# Altium schematic sheet CPU HMI.SchDoc
size A3; Engineer: T.Wadolowski; Address1: ul. Żurawia 71; Address2: 15-540 Bialystok; DocumentNumber: 1.0; SheetNumber: 1; SheetTotal: 1
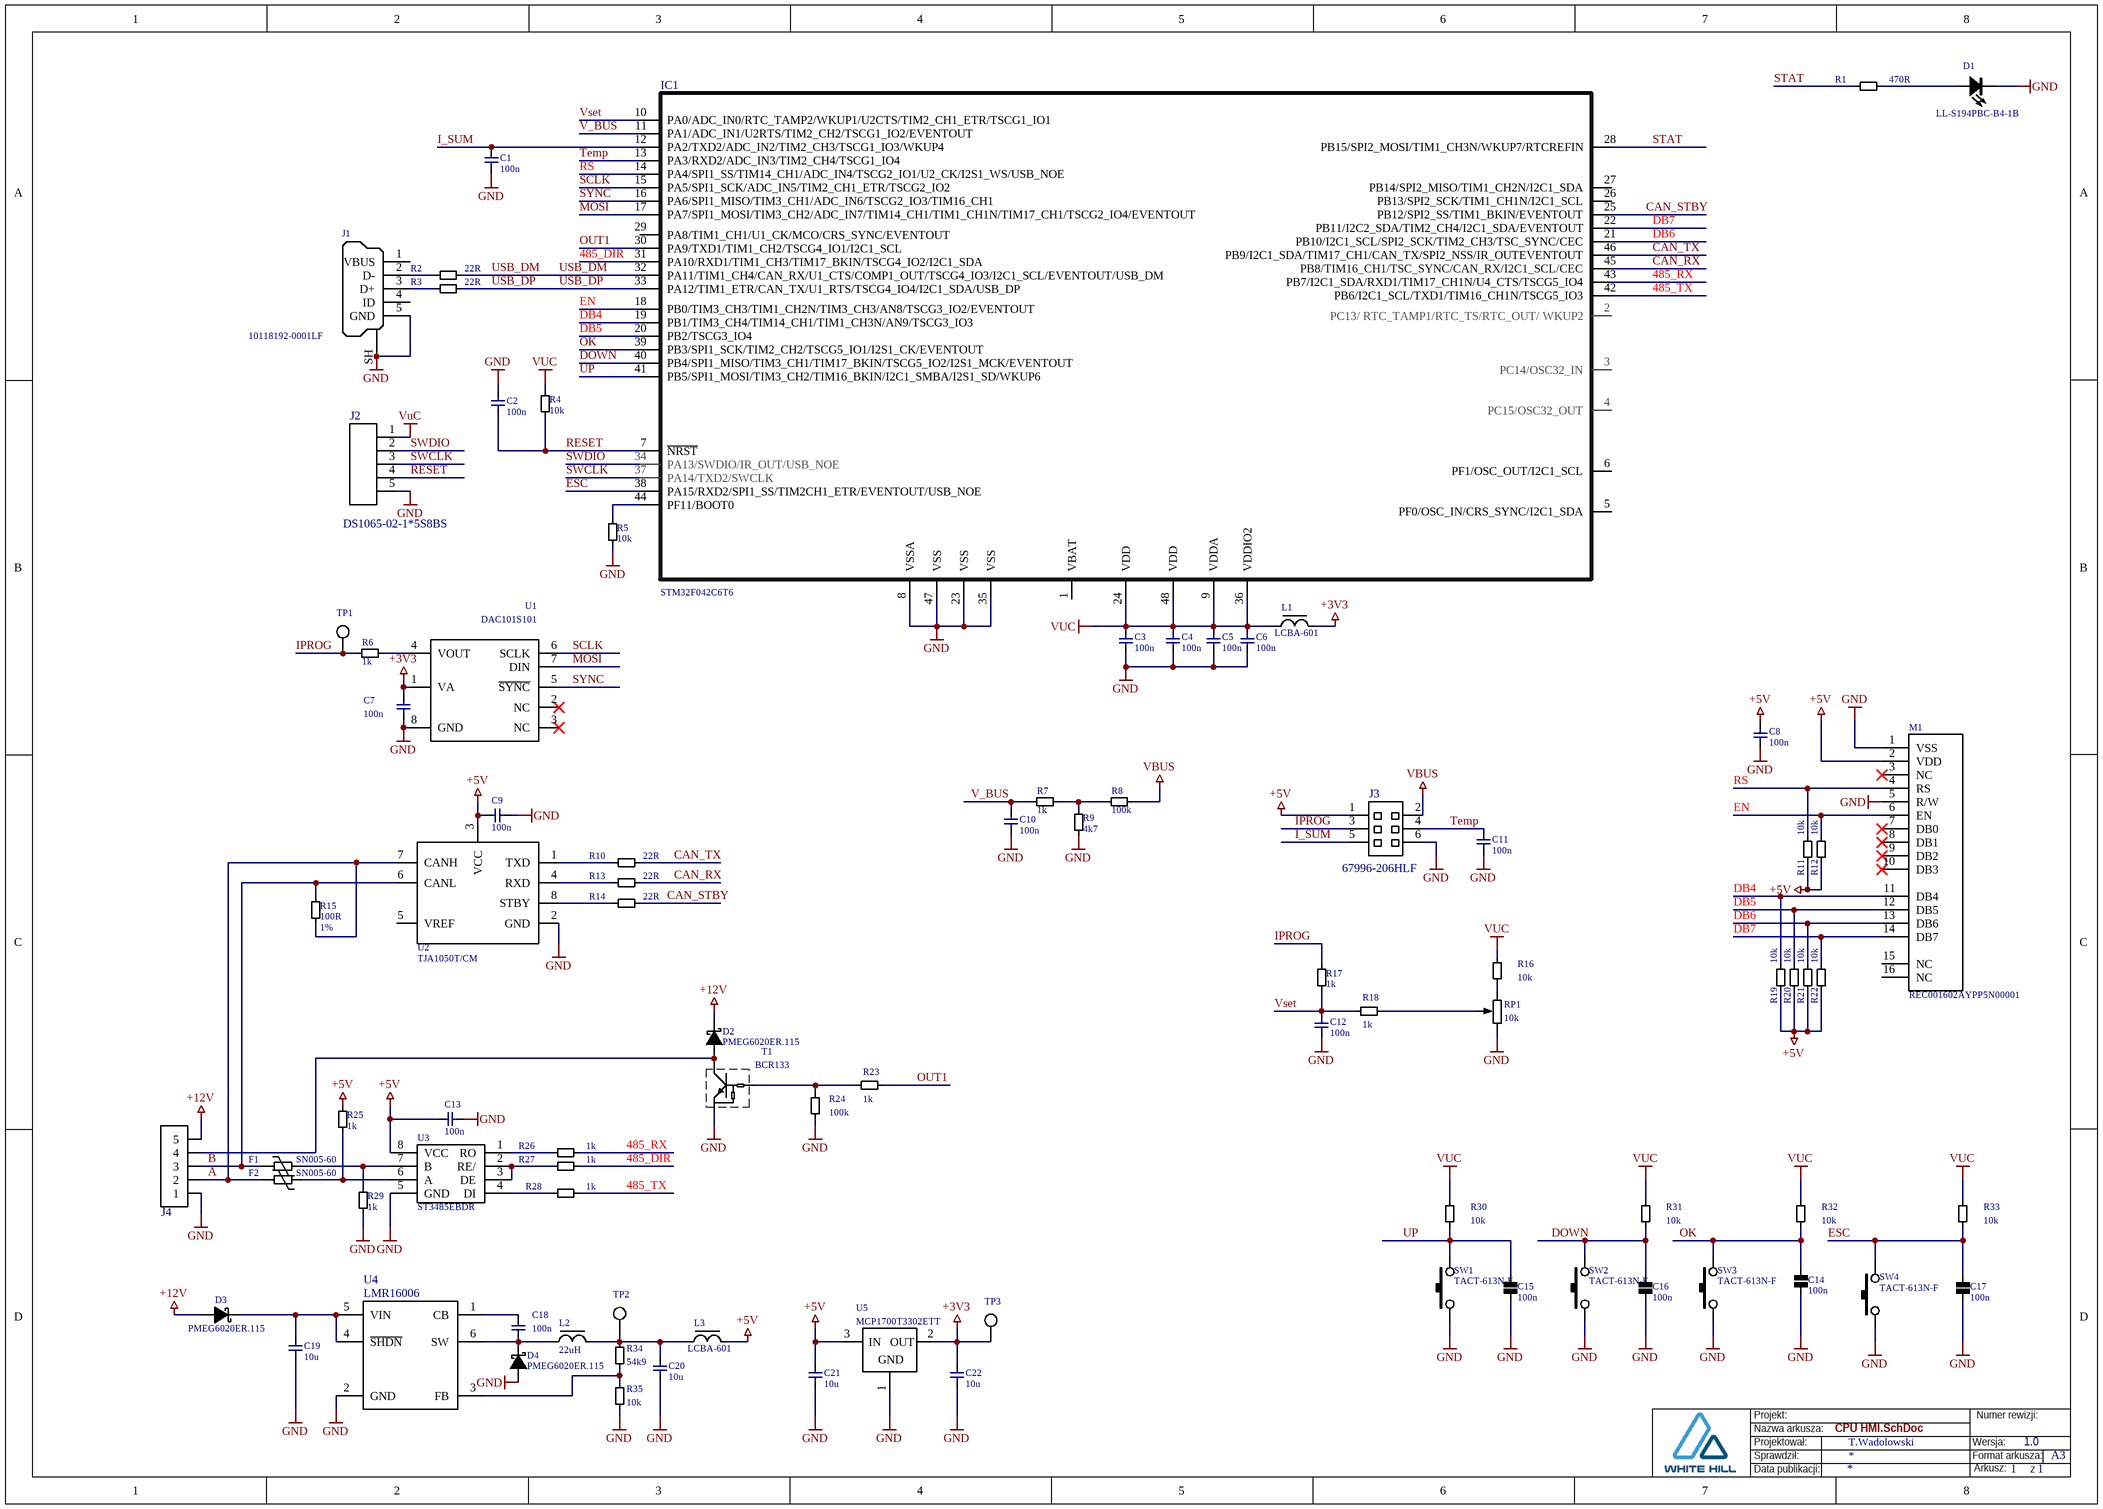
[diagram p0: CPU HMI.SchDoc]

## Parts
C1  100n  [C0603]
C2  100n  [C0603]
C3  100n  [C0603]
C4  100n  [C0603]
C5  100n  [C0603]
C6  100n  [C0603]
C7  100n  [C0603]
C8  100n  [C0603]
C9  100n  [C0603]
C10  100n  [C0603]
C11  100n  [C0603]
C12  100n  [C0603]
C13  100n  [C0603]
C14  100n  [C0603]
C15  100n  [C0603]
C16  100n  [C0603]
C17  100n  [C0603]
C18  100n  [C0603]
C19  10u  [C1206]
C20  10u  [C1206]
C21  10u  [C0805-10]
C22  10u  [C0805-10]
D1  LL-S194PBC-B4-1B  [LED0603B]
D2  PMEG6020ER.115  [SOD123]
D3  PMEG6020ER.115  [SOD123]
D4  PMEG6020ER.115  [SOD123]
F1  SN005-60  [F1206]
F2  SN005-60  [F1206]
IC1  STM32F042C6T6  [LQFP-48]
J1  10118192-0001LF  [USB-M-H]
J2  DS1065-02-1*5S8BS  [SIP-5 1.27-SMT -F]
J3  67996-206HLF  [GP2x3]
J4  *  [MC 1,5/5-G-3,81]  (value not drawn)
L1  LCBA-601  [R0603]
L2  22uH  [L4040]
L3  LCBA-601  [R0603]
M1  REC001602AYPP5N00001  [LCD16*2]
R1  470R  [R0603]
R2  22R  [R0603]
R3  22R  [R0603]
R4  10k  [R0603]
R5  10k  [R0603]
R6  1k  [R0603]
R7  1k  [R0603]
R8  100k  [R0603]
R9  4k7  [R0603]
R10  22R  [R0603]
R11  10k  [R0603]
R12  10k  [R0603]
R13  22R  [R0603]
R14  22R  [R0603]
R15  100R  Tolerance: 1%  [R0805]
R16  10k  [R0603]
R17  1k  [R0603]
R18  1k  [R0603]
R19  10k  [R0603]
R20  10k  [R0603]
R21  10k  [R0603]
R22  10k  [R0603]
R23  1k  [R0603]
R24  100k  [R0603]
R25  1k  [R0603]
R26  1k  [R0603]
R27  1k  [R0603]
R28  1k  [R0603]
R29  1k  [R0603]
R30  10k  [R0603]
R31  10k  [R0603]
R32  10k  [R0603]
R33  10k  [R0603]
R34  54k9  [R0603]
R35  10k  [R0603]
RP1  10k  [RK_POT]
SW1  TACT-613N-F  [MSWITCH 13]
SW2  TACT-613N-F  [MSWITCH 13]
SW3  TACT-613N-F  [MSWITCH 13]
SW4  TACT-613N-F  [MSWITCH 13]
T1  BCR133  [SOT-23]
TP1  TP  [TP]  (value not drawn)  (no BOM)
TP2  TP  [TP]  (value not drawn)  (no BOM)
TP3  TP  [TP]  (value not drawn)  (no BOM)
U1  DAC101S101  [MSOP-8]
U2  TJA1050T/CM  [SO-8]
U3  ST3485EBDR  [SO-8]
U4  LMR16006  [SOT-23-6]
U5  MCP1700T3302ETT  [SOT-23]

## Nets
+3V3: C7.1 C22.1 L1.2 TP3.1 U1.1(VA) U5.2(VOUT)
+5V: C8.2 C9.1 C13.1 C21.1 J3.1 L3.2 M1.2(VDD) R11.1(TOP) R12.1(TOP) R19.1(TOP) R20.1(TOP) R21.1(TOP) R22.1(TOP) R25.1(TOP) U2.3(VCC) U3.8(VCC) U5.3(VIN)
+12V: D2.2(K) D3.1(A) J4.5
GND: C1.2 C2.1 C3.1 C4.1 C5.1 C6.1 C7.2 C8.1 C9.2 C10.2 C11.2 C12.1 C13.2 C14.2 C15.2 C16.2 C17.2 C19.2 C20.2 C21.2 C22.2 D1.K D4.1(A) IC1.8(VSSA) IC1.23(VSS) IC1.35(VSS) IC1.47(VSS) J1.5(GND) J1.SH(Shell) J2.5 J3.6 J4.1 M1.1(VSS) M1.5(R/W) R5.1(TOP) R9.1(TOP) R24.1(TOP) R29.2(BOT) R35.1(TOP) RP1.1 SW1.1 SW2.1 SW3.1 SW4.1 T1.2(E) U1.8(GND) U2.2(GND) U3.5(GND) U4.2(GND) U5.1(GND)
VBUS: J3.2 R8.2(BOT)
VUC: C3.2 C4.2 C5.2 C6.2 IC1.9(VDDA) IC1.24(VDD) IC1.36(VDDIO2) IC1.48(VDD) J2.1 L1.1 R4.1(TOP) R16.2(BOT) R30.2(BOT) R31.2(BOT) R32.2(BOT) R33.2(BOT)
485_DIR: IC1.31(PA10/RXD1/TIM1_CH3/TIM17_BKIN/TSCG4_IO2/I2C1_SDA) R27.1(TOP)
485_RX: IC1.43(PB7/I2C1_SDA/RXD1/TIM17_CH1N/U4_CTS/TSCG5_IO4) R26.1(TOP)
485_TX: IC1.42(PB6/I2C1_SCL/TXD1/TIM16_CH1N/TSCG5_IO3) R28.1(TOP)
A: F2.2(BOT) J4.2 R15.1(TOP) U2.7(CANH)
B: F1.2(BOT) J4.3 R15.2(BOT) U2.6(CANL)
CAN_RX: IC1.45(PB8/TIM16_CH1/TSC_SYNC/CAN_RX/I2C1_SCL/CEC) R13.2(BOT)
CAN_STBY: IC1.25(PB12/SPI2_SS/TIM1_BKIN/EVENTOUT) R14.2(BOT)
CAN_TX: IC1.46(PB9/I2C1_SDA/TIM17_CH1/CAN_TX/SPI2_NSS/IR_OUTEVENTOUT) R10.2(BOT)
DB4: IC1.19(PB1/TIM3_CH4/TIM14_CH1/TIM1_CH3N/AN9/TSCG3_IO3) M1.11(DB4) R19.2(BOT)
DB5: IC1.20(PB2/TSCG3_IO4) M1.12(DB5) R20.2(BOT)
DB6: IC1.21(PB10/I2C1_SCL/SPI2_SCK/TIM2_CH3/TSC_SYNC/CEC) M1.13(DB6) R21.2(BOT)
DB7: IC1.22(PB11/I2C2_SDA/TIM2_CH4/I2C1_SDA/EVENTOUT) M1.14(DB7) R22.2(BOT)
DOWN: C16.1 IC1.40(PB4/SPI1_MISO/TIM3_CH1/TIM17_BKIN/TSCG5_IO2/I2S1_MCK/EVENTOUT) R31.1(TOP) SW2.2
EN: IC1.18(PB0/TIM3_CH3/TIM1_CH2N/TIM3_CH3/AN8/TSCG3_IO2/EVENTOUT) M1.6(EN) R12.2(BOT)
ESC: C17.1 IC1.38(PA15/RXD2/SPI1_SS/TIM2CH1_ETR/EVENTOUT/USB_NOE) R33.1(TOP) SW4.2
I_SUM: C1.1 IC1.12(PA2/TXD2/ADC_IN2/TIM2_CH3/TSCG1_IO3/WKUP4) J3.5
IPROG: J3.3 R6.2(BOT) R17.1(TOP) TP1.1
MOSI: IC1.17(PA7/SPI1_MOSI/TIM3_CH2/ADC_IN7/TIM14_CH1/TIM1_CH1N/TIM17_CH1/TSCG2_IO4/EVENTOUT) U1.7(DIN)
OK: C14.1 IC1.39(PB3/SPI1_SCK/TIM2_CH2/TSCG5_IO1/I2S1_CK/EVENTOUT) R32.1(TOP) SW3.2
OUT1: IC1.30(PA9/TXD1/TIM1_CH2/TSCG4_IO1/I2C1_SCL) R23.1(TOP)
RESET: C2.2 IC1.7(~{NRST}) J2.4 R4.2(BOT)
RS: IC1.14(PA4/SPI1_SS/TIM14_CH1/ADC_IN4/TSCG2_IO1/U2_CK/I2S1_WS/USB_NOE) M1.4(RS) R11.2(BOT)
SCLK: IC1.15(PA5/SPI1_SCK/ADC_IN5/TIM2_CH1_ETR/TSCG2_IO2) U1.6(SCLK)
STAT: IC1.28(PB15/SPI2_MOSI/TIM1_CH3N/WKUP7/RTCREFIN) R1.1(TOP)
SWCLK: IC1.37(PA14/TXD2/SWCLK) J2.3
SWDIO: IC1.34(PA13/SWDIO/IR_OUT/USB_NOE) J2.2
SYNC: IC1.16(PA6/SPI1_MISO/TIM3_CH1/ADC_IN6/TSCG2_IO3/TIM16_CH1) U1.5(~{SYNC})
Temp: C11.1 IC1.13(PA3/RXD2/ADC_IN3/TIM2_CH4/TSCG1_IO4) J3.4
UP: C15.1 IC1.41(PB5/SPI1_MOSI/TIM3_CH2/TIM16_BKIN/I2C1_SMBA/I2S1_SD/WKUP6) R30.1(TOP) SW1.2
USB_DM: IC1.32(PA11/TIM1_CH4/CAN_RX/U1_CTS/COMP1_OUT/TSCG4_IO3/I2C1_SCL/EVENTOUT/USB_DM) R2.2(BOT)
USB_DP: IC1.33(PA12/TIM1_ETR/CAN_TX/U1_RTS/TSCG4_IO4/I2C1_SDA/USB_DP) R3.2(BOT)
V_BUS: C10.1 IC1.11(PA1/ADC_IN1/U2RTS/TIM2_CH2/TSCG1_IO2/EVENTOUT) R7.1(TOP)
Vset: C12.2 IC1.10(PA0/ADC_IN0/RTC_TAMP2/WKUP1/U2CTS/TIM2_CH1_ETR/TSCG1_IO1) R17.2(BOT) R18.2(BOT)
NetC18_1: C18.1 U4.1(CB)
NetC18_2: C18.2 D4.2(K) L2.1 U4.6(SW)
NetC19_1: C19.1 D3.2(K) U4.4(~{SHDN}) U4.5(VIN)
NetC20_1: C20.1 L2.2 L3.1 R34.2(BOT) TP2.1
NetD1_A: D1.A R1.2(BOT)
NetD2_1: D2.1(A) J4.4 T1.3(C)
NetF1_1: F1.1(TOP) R29.1(TOP) U3.7(B)
NetF2_1: F2.1(TOP) R25.2(BOT) U3.6(A)
NetIC1_44: IC1.44(PF11/BOOT0) R5.2(BOT)
NetJ1_2: J1.2(D-) R2.1(TOP)
NetJ1_3: J1.3(D+) R3.1(TOP)
NetR6_1: R6.1(TOP) U1.4(VOUT)
NetR7_2: R7.2(BOT) R8.1(TOP) R9.2(BOT)
NetR10_1: R10.1(TOP) U2.1(TXD)
NetR13_1: R13.1(TOP) U2.4(RXD)
NetR14_1: R14.1(TOP) U2.8(STBY)
NetR16_1: R16.1(TOP) RP1.3
NetR18_1: R18.1(TOP) RP1.2
NetR23_2: R23.2(BOT) R24.2(BOT) T1.1(B)
NetR26_2: R26.2(BOT) U3.1(RO)
NetR27_2: R27.2(BOT) U3.2(RE/) U3.3(DE)
NetR28_2: R28.2(BOT) U3.4(DI)
NetR34_1: R34.1(TOP) R35.2(BOT) U4.3(FB)

Not connected (* = marked no-connect by the designer): IC1 1(VBAT) 2(PC13/_RTC_TAMP1/RTC_TS/RTC_OUT/_WKUP2) 3(PC14/OSC32_IN) 4(PC15/OSC32_OUT) 5(PF0/OSC_IN/CRS_SYNC/I2C1_SDA) 6(PF1/OSC_OUT/I2C1_SCL) 26(PB13/SPI2_SCK/TIM1_CH1N/I2C1_SCL) 27(PB14/SPI2_MISO/TIM1_CH2N/I2C1_SDA) 29(PA8/TIM1_CH1/U1_CK/MCO/CRS_SYNC/EVENTOUT); J1 1(VBUS) 4(ID); M1 3(NC)* 7(DB0)* 8(DB1)* 9(DB2)* 10(DB3)* 15(NC) 16(NC); U1 2(NC)* 3(NC)*; U2 5(VREF)

## Notes on the sheet
- Projekt:
- Projektował:
- Sprawdził:
- Nazwa arkusza:
- Wersja:
- Format arkusza:
- Numer rewizji:
- A3
- Data publikacji:
- Arkusz:
- z
- (in symbol MCP1700) IN; OUT

## Library data of the parts
C1-C13 C18 = C-013: Capacitor: ceramic; 100nF; 50V; X7R; ±10%; SMD; 0603; Series: GRM; Manufacturer: Murata; Part Number: GRM188R71H104KA93D; Indeks: C-0013; Value: 100n; ComponentLink1Description: Datasheet; ComponentLink1URL: D:\Datasheets\.pdf; Supplier: TME; Supplier Code: GRM188R71H104KA93D; ComponentLink2Description: Dostawca; ComponentLink2URL: http://www.tme.eu/pl/katalog/?idp=1&search=GRM188R71H104KA93D
C14-C17 = C: Kondensator: ceramiczny; MLCC; 100nF; 50V; X7R; ±5%; SMD; 0603; Manufacturer: Samsung; Part Number: CL10B104JB8NNNC; Value: 100n; ComponentLink1Description: Datasheet; ComponentLink1URL: D:\Datasheets\.pdf; Supplier: TME; Supplier Code: CL10B104JB8NNNC; ComponentLink2Description: Dostawca; ComponentLink2URL: http://www.tme.eu/pl/katalog/?cleanParameters=1&searchClick=1&search=CL10B104JB8NNNC
C19 C20 = C-022: Capacitor: ceramic; 10uF; 35V; X7R; ±10%; SMD; 1206; Manufacturer: Samnsung; Part Number: CL31B106KLHNNNE; Indeks: C-0019; Value: 10u; ComponentLink1Description: Datasheet; ComponentLink1URL: D:\Datasheets\.pdf; Supplier: TME; Supplier Code: CL31B106KLHNNNE; ComponentLink2Description: Dostawca; ComponentLink2URL: http://www.tme.eu/pl/katalog/?idp=1&search=CL31B106KLHNNNE
C21 C22 = C-019: Capacitor: ceramic; MLCC; 10uF; 16V; X5R; ±10%; SMD; 0805; Manufacturer: Samnsung; Part Number: CL21A106KOQNNNG; Indeks: C-0019; Value: 10u; ComponentLink1Description: Datasheet; ComponentLink1URL: D:\Datasheets\.pdf; Supplier: TME; Supplier Code: CL21A106KOQNNNG; ComponentLink2Description: Dostawca; ComponentLink2URL: http://www.tme.eu/pl/katalog/?idp=1&search=CL21A106KOQNNNG
D1 = LED_1: LED; SMD; 0603; blue; 20-40mcd; 1.6x0.8x0.4mm; 130°; 2.8÷3.8V; 20mA; Manufacturer: LuckyLight; Value: LL-S194PBC-B4-1B; ComponentLink1Description: Datasheet; ComponentLink1URL: D:\Datasheets\.pdf; Part Number: LL-S194PBC-B4-1B; Supplier: TME; Supplier Code: LL-S194PBC-B4-1B; ComponentLink2Description: Dostawca
D2-D4 = STPS2H100A: Diode: Schottky rectifying; SMD; 60V; 2A; SOD123W; Manufacturer: Nexperia; ComponentLink1Description: Datasheet; ComponentLink1URL: E:\Datasheets\PMEG6020ER.115.pdf; Supplier: TME; Supplier Code: PMEG6020ER.115; ComponentLink2Description: Dostawca; ComponentLink2URL: http://www.tme.eu/pl/katalog/?idp=1&search=PMEG6020ER.115; Value: PMEG6020ER.115
F1 F2 = SN005-60: Bezpiecznik: polimerowy PTC; 50mA; Obud:1206; Manufacturer: ECE; Value: SN005-60; ComponentLink1Description: Datasheet; ComponentLink1URL: D:\Datasheets\ECE.pdf; Part Number: SN005-60; Supplier: TME; Supplier Code: SN005-60; ComponentLink2Description: Dostawca; ComponentLink2URL: http://www.tme.eu/pl/katalog/?idp=1&search=SN005-60
IC1 = STM32F042C6x: ARM microcontroller; Flash:32kB; 48MHz; SRAM:6kB; LQFP48; Manufacturer: ST; Indeks: IC-080; Cena 1000: 7,9; Cena100: 9,17; Supplier: TME; Part Number: STM32F042C6T6; Supplier Code: STM32F042C6T6; ComponentLink1Description: Datasheet; ComponentLink1URL: D:\Biznes-projekty\Datasheets\STM32F042C6T6.pdf; ComponentLink2Description: Dostawca; ComponentLink2URL: http://www.tme.eu/pl/katalog/?idp=1&search=STM32F042C6T6; Value: STM32F042C6T6
J1 = USB micro hor: Socket; USB B micro; on PCBs; SMT; PIN:5; horizontal; V: USB 2.0; Manufacturer: Amphenol; Value: 10118192-0001LF; ComponentLink1Description: Datasheet; ComponentLink1URL: D:\Datasheets\10118192-0001LF.pdf; Part Number: 10118192-0001LF; Supplier: TME; Supplier Code: 10118192-0001LF/C; ComponentLink2Description: Dostawca; ComponentLink2URL: http://www.tme.eu/pl/katalog/?idp=1&search=10118192-0001LF/C
J2 = CON5_PRG ST: Socket; pin strips; female; PIN:5; straight; 1.27mm; SMT; 1x5; 1A; Manufacturer: Connfly; Value: DS1065-02-1*5S8BS; ComponentLink1Description: Datasheet; ComponentLink1URL: D:\Datasheets\DS1065-02.pdf; Part Number: DS1065-02-1*5S8BS; Supplier: TME; Supplier Code: DS1065-02-1*5S8BS; ComponentLink2Description: Dostawca; ComponentLink2URL: http://www.tme.eu/pl/katalog/?idp=1&search=DS1065-02-1*5S8BS
J3 = CON2x3: Pin header; pin strips; male;2.54mm; PIN:6; THT; Manufacturer: Amphenol; Value: 67996-206HLF; ComponentLink1Description: Datasheet; ComponentLink1URL: D:\Datasheets\.pdf; Part Number: 67996-206HLF; Supplier: TME; Supplier Code: 67996-206HLF; ComponentLink2Description: Dostawca
J4 = CON5: Złącze; Indeks: ZL; Value: *; Supplier: *; Supplier Code: *; ComponentLink1Description: Datasheet; ComponentLink1URL: D:\Biznes-projekty\Datasheets\.pdf
L1 L3 = LCBA-601: Ferrite: bead; Imp.@ 100MHz:600Ohm; Mounting: SMD; 1A; Case:0603; Manufacturer: Ferrocore; Indeks: IND; Supplier: TME; Supplier Code: LCBA-601; ComponentLink1Description: Datasheet; ComponentLink1URL: D:\Datasheets\.pdf; Part Number: LCBA-601; ComponentLink2Description: Dostawca; Value: LCBA-601
L2 = L4040: Inductor: wire; SMD; 1515; 22uH; 790mA; 0.37R; 4x4x1.65mm; Manufacturer: Murata; Part Number: LQH44PN220MP0L; Indeks: IND; Supplier: TME; Supplier Code: LQH44PN220MP0L; ComponentLink1Description: Datasheet; ComponentLink1URL: D:\Datasheets\.pdf; ComponentLink2Description: Dostawca; Value: 22uH
M1 = OLED 2X16: Display: OLED; alphanumeric; 16x2; Window dimensions:66x16mm; Manufacturer: RAYSTAR; Value: REC001602AYPP5N00001; ComponentLink1Description: Datasheet; ComponentLink1URL: D:\Datasheets\REC001602AYPP5N00001.pdf; Part Number: REC001602AYPP5N00001; Supplier: TME; Supplier Code: REC001602AYPP5N0; ComponentLink2Description: Dostawca; ComponentLink2URL: http://www.tme.eu/pl/katalog/?idp=1&search=REC001602AYPP5N0
R1 = R-004: Resistor: thick film; SMD; 0603; 470R; 0.1W; ±5%; Manufacturer: Royal Ohm; Part Number: 0603SAJ0471T5E; Value: 470R; ComponentLink1Description: Datasheet; ComponentLink1URL: D:\Datasheets\.pdf; Supplier: TME; Supplier Code: SMD0603-470R; Indeks: R-004; ComponentLink2Description: Dostawca; ComponentLink2URL: http://www.tme.eu/pl/katalog/?idp=1&search=SMD0603-470R; Tolerance: 5%
R2 R3 R10 R13 R14 = R-002: Resistor: thick film; SMD; 0603; 22R; 0.1W; ±5%;; Manufacturer: Royal Ohm; Part Number: 0603SAJ0220T5E; Value: 22R; ComponentLink1Description: Datasheet; ComponentLink1URL: D:\Datasheets\.pdf; Supplier: TME; Supplier Code: SMD0603-22R; Indeks: R-002; ComponentLink2Description: Dostawca; ComponentLink2URL: http://www.tme.eu/pl/katalog/?idp=1&search=SMD0603-22R; Tolerance: 5%
R4 R5 R11 R12 R16 R19-R22 R30-R33 R35 = R-012: Resistor: thick film; SMD; 0603; 10k; 0.125W; ±5%; Manufacturer: Walsin; Part Number: WF06P103JTL; Indeks: R-011; Value: 10k; ComponentLink1Description: Datasheet; ComponentLink1URL: D:\Datasheets\.pdf; Supplier: TME; Supplier Code: WF06P-10K-5%; ComponentLink2Description: Dostawca; ComponentLink2URL: http://www.tme.eu/pl/katalog/?idp=1&search=WF06P-10K-5%; Tolerance: 5%
R6 R7 R17 R18 R23 R25-R29 = R-005: Resistor: thick film; SMD; 0603; 1k; 0.1W; ±5%; Manufacturer: Royal Ohm; Part Number: 0603SAJ0102T5E; Indeks: R-004; Value: 1k; ComponentLink1Description: Datasheet; ComponentLink1URL: D:\Datasheets\.pdf; Supplier: TME; Supplier Code: SMD0603-1K; ComponentLink2Description: Dostawca; ComponentLink2URL: http://www.tme.eu/pl/katalog/?idp=1&search=SMD0603-1K; Tolerance: 5%
R8 R24 = R-013: Resistor: thick film; SMD; 0603; 100k; 0.125W; ±5%; Manufacturer: Walsin; Part Number: WF06P104JTL; Indeks: R-011; Value: 100k; ComponentLink1Description: Datasheet; ComponentLink1URL: D:\Datasheets\.pdf; Supplier: TME; Supplier Code: WF06P-100K-5%; ComponentLink2Description: Dostawca; ComponentLink2URL: http://www.tme.eu/pl/katalog/?idp=1&search=WF06P-100K-5%; Tolerance: 5%
R9 = R-011: Resistor: thick film; SMD; 0603; 4.7k; 0.125W; ±5%; Manufacturer: Walsin; Part Number: WF06P472JTL; Value: 4k7; ComponentLink1Description: Datasheet; ComponentLink1URL: D:\Datasheets\.pdf; Supplier: TME; Supplier Code: WF06P-4K7-5%; Indeks: R-011; ComponentLink2Description: Dostawca; ComponentLink2URL: http://www.tme.eu/pl/katalog/?idp=1&search=WF06P-4K7-5%; Tolerance: 5%
R15 = R-017: Resistor: thick film; SMD; 0805; 100R; 0.125W; ±1%; Manufacturer: Royal Ohm; Part Number: CRCW0805100RFKTABC; Indeks: R-015; Value: 100R; ComponentLink1Description: Datasheet; ComponentLink1URL: D:\Datasheets\.pdf; Supplier: TME; Supplier Code: CRCW0805100RFKTABC; ComponentLink2Description: Dostawca; ComponentLink2URL: http://www.tme.eu/pl/katalog/?idp=1&search=CRCW0805100RFKTABC
R34 = R-016: Resistor: thick film; SMD; 0603; 54.9k; 0.1W; ±1%;; Manufacturer: Yageo; Part Number: RC0603FR-0754K9L; Value: 54k9; ComponentLink1Description: Datasheet; ComponentLink1URL: D:\Datasheets\.pdf; Supplier: TME; Supplier Code: RC0603FR-0754K9L; Indeks: R-016; ComponentLink2Description: Dostawca; ComponentLink2URL: http://www.tme.eu/pl/katalog/?idp=1&search=RC0603FR-0754K9L; Tolerance: 1%
RP1 = POT: Potentiometer: shaft; balance, single turn, vertical; 10kOhm; ±20%; Manufacturer: Alps; Part Number: RK09K1130081; Value: 10k; ComponentLink1Description: Datasheet; ComponentLink1URL: D:\Datasheets\.pdf; Supplier: TME; Supplier Code: RK09K1130081; ComponentLink2Description: Dostawca; ComponentLink2URL: http://www.tme.eu/pl/katalog/?idp=1&search=RK09K1130081
SW1-SW4 = MSWITCH: Mikroprzełacznik; 1-pozycyjne; SPST-NO; 0,05A/12VDC; THT; 1,6N; Value: TACT-613N-F; ComponentLink1Description: Datasheet; ComponentLink1URL: D:\Datasheets\.pdf; Supplier: TME; Supplier Code: TACT-613N-F; ComponentLink2Description: Dostawca; ComponentLink2URL: http://www.tme.eu/pl/katalog/?idp=1&search=
T1 = BCR133: NPN Silicon Digital Transistor 10kOhm; Manufacturer: Infineon; Part Number: BCR133E6327; ComponentLink1Description: Datasheet; ComponentLink1URL: D:\Datasheets\BCR133.pdf; Supplier: TME; Supplier Code: BCR133E6327; ComponentLink2Description: Dostawca; ComponentLink2URL: http://www.tme.eu/pl/katalog/?idp=1&search=BCR133E6327; Value: BCR133
TP1-TP3 = TP: Test point; ComponentLink1Description: Datasheet; ComponentLink1URL: D:\Datasheets\.pdf; ComponentLink2Description: Dostawca
U1 = DAC101S101: D/A converter; 10bit; Channels:4; 2.7÷5.5VDC; MSOP8; Manufacturer: TI; Part Number: DAC101S101CIMM/NOPB; Value: DAC101S101; ComponentLink1Description: Datasheet; ComponentLink1URL: e:\Datasheets\dac101s101.pdf; Supplier: Mouser; Supplier Code: 926-DA101S101CIMMNPB; ComponentLink2Description: Dostawca; ComponentLink2URL: https://pl.mouser.com/Search/Refine?Keyword=DAC101S101CIMM%2fNOPB
U2 = TJA1050T: High speed CAN transceiver; Manufacturer: NXP; Value: TJA1050T/CM; ComponentLink1Description: Datasheet; ComponentLink1URL: D:\Datasheets\TJA1050.pdf; Part Number: TJA1050T/CM; Supplier: TME; Supplier Code: TJA1050T/CM; ComponentLink2Description: Dostawca; ComponentLink2URL: http://www.tme.eu/pl/katalog/?idp=1&search= TJA1050T/CM
U3 = MAX3485: Nadajnik-odbiornik linii; RS422 / RS485; 3,3VDC; SO8; Manufacturer: ST; Value: ST3485EBDR; ComponentLink1Description: Datasheet; ComponentLink1URL: D:\Datasheets\.pdf; Part Number: ST3485EBDR; Supplier: TME; Supplier Code: ST3485EBD; ComponentLink2Description: Dostawca
U4 = LMR16006: 60 V 0.6 A Buck Regulators With High Efficiency ECO  Mode; Manufacturer: ST; Part Number: LMR16006XDDCR; Supplier Code: 2781719; ComponentLink1URL: E:\Datasheets\lmr16006.pdf; ComponentLink1Description: Datasheet; Supplier: Farnell; ComponentLink2Description: Dostawca; ComponentLink2URL: http://pl.farnell.com/search?st=2781719; Value: LMR16006
U5 = MCP1700: Micropower 3.3V 250mA LDO Regulator; Manufacturer: Microchip; Value: MCP1700T3302ETT; ComponentLink1Description: Datasheet; ComponentLink1URL: E:\Datasheets\.Mcp1700.pdf; Part Number: MCP1700T3302ETT; Supplier: TME; Supplier Code: MCP1700T3302ETT; ComponentLink2Description: Dostawca; ComponentLink2URL: http://www.tme.eu/pl/katalog/?idp=1&search=MCP1700T3302ETT